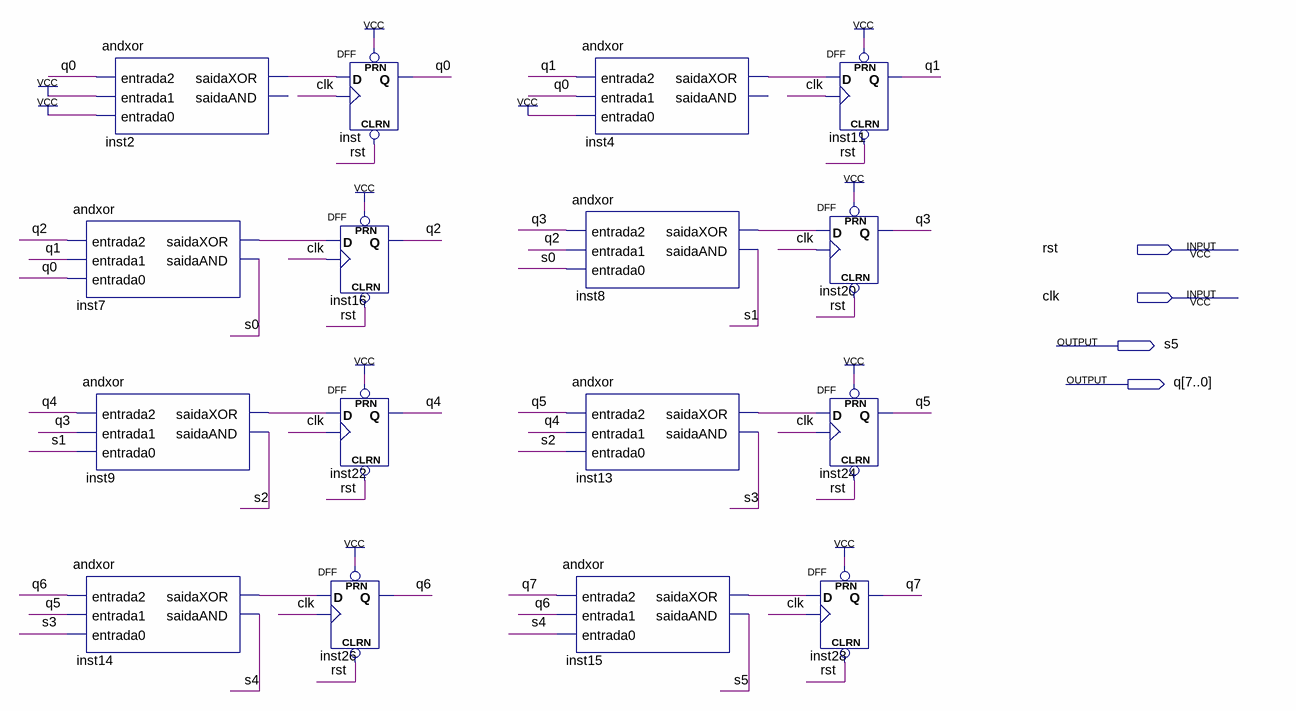
[diagram p0: schematic sheet]
// Quartus schematic pcup.bdf as structural Verilog: 16 symbols, 4 pins
module pcup (
  input  rst,
  input  clk,
  output s5,
  output [7:0] q
);

  wire inst2_saidaxor, inst4_saidaxor, inst7_saidaxor, inst8_saidaxor, inst9_saidaxor, inst13_saidaxor,
       inst14_saidaxor, inst15_saidaxor, s0, s1, s2, s3, s4;

  andxor inst2 (.entrada2(q[0]), .entrada1(1'b1), .entrada0(1'b1), .saidaXOR(inst2_saidaxor));  // open: saidaAND
  andxor inst7 (.entrada2(q[2]), .entrada1(q[1]), .entrada0(q[0]), .saidaXOR(inst7_saidaxor), .saidaAND(s0));
  andxor inst9 (.entrada2(q[4]), .entrada1(q[3]), .entrada0(s1), .saidaXOR(inst9_saidaxor), .saidaAND(s2));
  andxor inst14 (.entrada2(q[6]), .entrada1(q[5]), .entrada0(s3), .saidaXOR(inst14_saidaxor), .saidaAND(s4));
  DFF inst (.CLRN(rst), .CLK(clk), .D(inst2_saidaxor), .PRN(1'b1), .Q(q[0]));
  DFF inst16 (.CLRN(rst), .CLK(clk), .D(inst7_saidaxor), .PRN(1'b1), .Q(q[2]));
  DFF inst22 (.CLRN(rst), .CLK(clk), .D(inst9_saidaxor), .PRN(1'b1), .Q(q[4]));
  DFF inst26 (.CLRN(rst), .CLK(clk), .D(inst14_saidaxor), .PRN(1'b1), .Q(q[6]));
  andxor inst4 (.entrada2(q[1]), .entrada1(q[0]), .entrada0(1'b1), .saidaXOR(inst4_saidaxor));  // open: saidaAND
  andxor inst8 (.entrada2(q[3]), .entrada1(q[2]), .entrada0(s0), .saidaXOR(inst8_saidaxor), .saidaAND(s1));
  andxor inst13 (.entrada2(q[5]), .entrada1(q[4]), .entrada0(s2), .saidaXOR(inst13_saidaxor), .saidaAND(s3));
  andxor inst15 (.entrada2(q[7]), .entrada1(q[6]), .entrada0(s4), .saidaXOR(inst15_saidaxor), .saidaAND(s5));
  DFF inst11 (.CLRN(rst), .CLK(clk), .D(inst4_saidaxor), .PRN(1'b1), .Q(q[1]));
  DFF inst20 (.CLRN(rst), .CLK(clk), .D(inst8_saidaxor), .PRN(1'b1), .Q(q[3]));
  DFF inst24 (.CLRN(rst), .CLK(clk), .D(inst13_saidaxor), .PRN(1'b1), .Q(q[5]));
  DFF inst28 (.CLRN(rst), .CLK(clk), .D(inst15_saidaxor), .PRN(1'b1), .Q(q[7]));
endmodule
